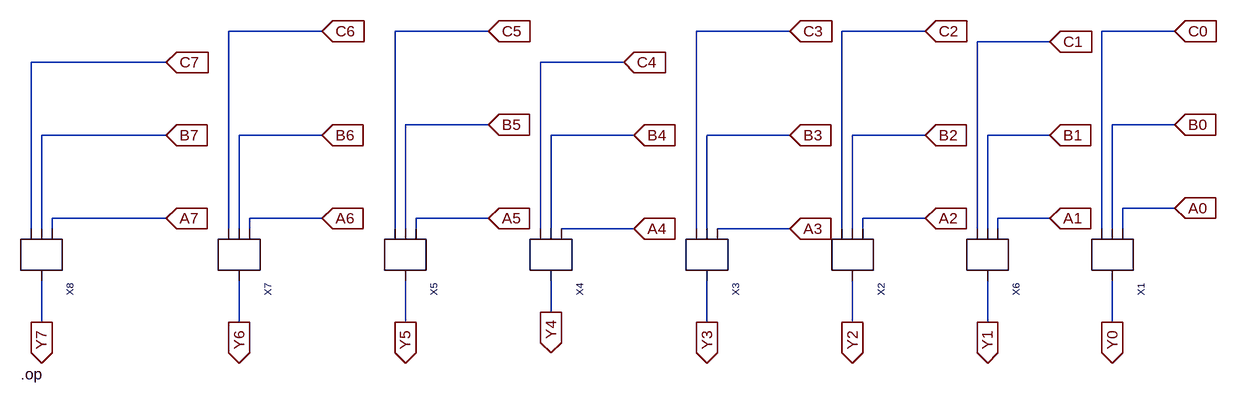
[diagram p0: schematic 8bit(XOR)_Part2.asc]
8bit(XOR)_Part2.asc, the LTspice schematic file:
Version 4
SHEET 1 1172 1092
WIRE -928 -32 -1072 -32
WIRE -672 -32 -816 -32
WIRE -208 -32 -352 -32
WIRE 0 -32 -128 -32
WIRE 384 -32 272 -32
WIRE 192 -16 80 -16
WIRE -1168 16 -1376 16
WIRE -464 16 -592 16
WIRE -672 112 -800 112
WIRE 384 112 288 112
WIRE -1168 128 -1360 128
WIRE -928 128 -1056 128
WIRE -448 128 -576 128
WIRE -208 128 -336 128
WIRE 0 128 -112 128
WIRE 192 128 96 128
WIRE 384 240 304 240
WIRE -1168 256 -1344 256
WIRE -928 256 -1040 256
WIRE -672 256 -784 256
WIRE 0 256 -96 256
WIRE 192 256 112 256
WIRE -1376 272 -1376 16
WIRE -1360 272 -1360 128
WIRE -1344 272 -1344 256
WIRE -1072 272 -1072 -32
WIRE -1056 272 -1056 128
WIRE -1040 272 -1040 256
WIRE -816 272 -816 -32
WIRE -800 272 -800 112
WIRE -784 272 -784 256
WIRE -592 272 -592 16
WIRE -576 272 -576 128
WIRE -448 272 -560 272
WIRE -352 272 -352 -32
WIRE -336 272 -336 128
WIRE -208 272 -320 272
WIRE -128 272 -128 -32
WIRE -112 272 -112 128
WIRE -96 272 -96 256
WIRE 80 272 80 -16
WIRE 96 272 96 128
WIRE 112 272 112 256
WIRE 272 272 272 -32
WIRE 288 272 288 112
WIRE 304 272 304 240
WIRE -576 400 -576 352
WIRE -1360 416 -1360 352
WIRE -1056 416 -1056 352
WIRE -800 416 -800 352
WIRE -336 416 -336 352
WIRE -112 416 -112 352
WIRE 96 416 96 352
WIRE 288 416 288 352
FLAG -1168 16 C7
IOPIN -1168 16 In
FLAG -928 -32 C6
IOPIN -928 -32 In
FLAG -672 -32 C5
IOPIN -672 -32 In
FLAG -464 16 C4
IOPIN -464 16 In
FLAG -208 -32 C3
IOPIN -208 -32 In
FLAG 0 -32 C2
IOPIN 0 -32 In
FLAG 192 -16 C1
IOPIN 192 -16 In
FLAG 384 -32 C0
IOPIN 384 -32 In
FLAG -1168 128 B7
IOPIN -1168 128 In
FLAG -1168 256 A7
IOPIN -1168 256 In
FLAG -928 128 B6
IOPIN -928 128 In
FLAG -928 256 A6
IOPIN -928 256 In
FLAG -672 112 B5
IOPIN -672 112 In
FLAG -672 256 A5
IOPIN -672 256 In
FLAG -448 128 B4
IOPIN -448 128 In
FLAG -448 272 A4
IOPIN -448 272 In
FLAG -208 128 B3
IOPIN -208 128 In
FLAG -208 272 A3
IOPIN -208 272 In
FLAG 0 128 B2
IOPIN 0 128 In
FLAG 0 256 A2
IOPIN 0 256 In
FLAG 192 128 B1
IOPIN 192 128 In
FLAG 192 256 A1
IOPIN 192 256 In
FLAG 384 112 B0
IOPIN 384 112 In
FLAG 384 240 A0
IOPIN 384 240 In
FLAG -1360 416 Y7
IOPIN -1360 416 Out
FLAG -1056 416 Y6
IOPIN -1056 416 Out
FLAG -800 416 Y5
IOPIN -800 416 Out
FLAG -576 400 Y4
IOPIN -576 400 Out
FLAG -336 416 Y3
IOPIN -336 416 Out
FLAG -112 416 Y2
IOPIN -112 416 Out
FLAG 96 416 Y1
IOPIN 96 416 Out
FLAG 288 416 Y0
IOPIN 288 416 Out
SYMBOL XOP_Part1 256 384 R90
SYMATTR InstName X1
SYMBOL XOP_Part1 -144 384 R90
SYMATTR InstName X2
SYMBOL XOP_Part1 -368 384 R90
SYMATTR InstName X3
SYMBOL XOP_Part1 -608 384 R90
SYMATTR InstName X4
SYMBOL XOP_Part1 -832 384 R90
SYMATTR InstName X5
SYMBOL XOP_Part1 64 384 R90
SYMATTR InstName X6
SYMBOL XOP_Part1 -1088 384 R90
SYMATTR InstName X7
SYMBOL XOP_Part1 -1392 384 R90
SYMATTR InstName X8
TEXT -1392 496 Left 2 !.op

The netlist it stands for:
* 8bit(XOR)_Part2.asc
XX1 A0 B0 C0 Y0 XOP_Part1  ; pins A B C Y
XX2 A2 B2 C2 Y2 XOP_Part1  ; pins A B C Y
XX3 A3 B3 C3 Y3 XOP_Part1  ; pins A B C Y
XX4 A4 B4 C4 Y4 XOP_Part1  ; pins A B C Y
XX5 A5 B5 C5 Y5 XOP_Part1  ; pins A B C Y
XX6 A1 B1 C1 Y1 XOP_Part1  ; pins A B C Y
XX7 A6 B6 C6 Y6 XOP_Part1  ; pins A B C Y
XX8 A7 B7 C7 Y7 XOP_Part1  ; pins A B C Y
.op
.backanno
.end